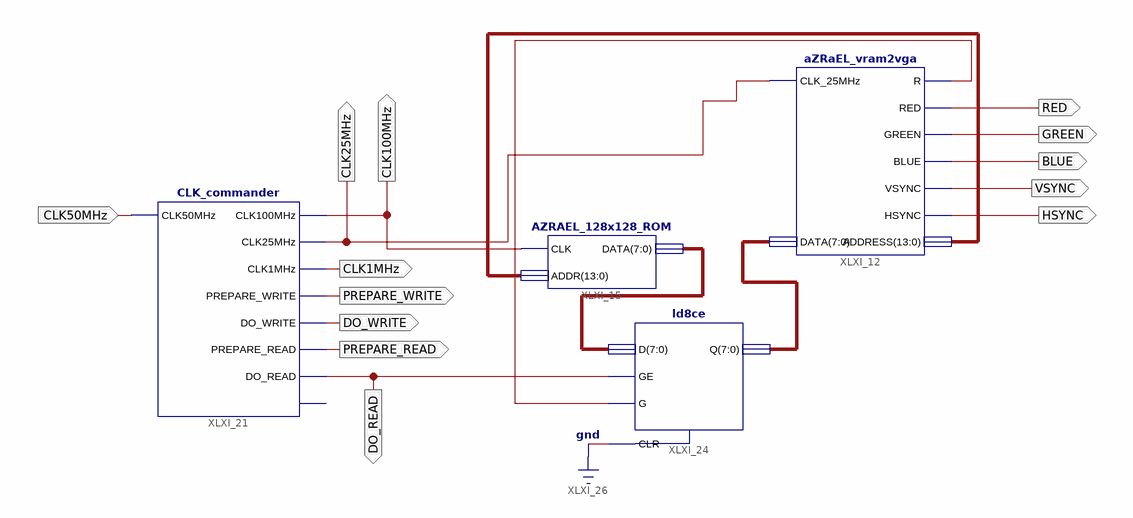
[diagram p0: schematic sheet 1]
// Xilinx ISE schematic aZRaEL2.sch (spartan3) as structural Verilog: 4 symbols, 13 ports
module aZRaEL2 (
  input  CLK50MHz,
  output RED,
  output GREEN,
  output BLUE,
  output VSYNC,
  output HSYNC,
  output DO_READ,
  output CLK1MHz,
  output PREPARE_WRITE,
  output DO_WRITE,
  output PREPARE_READ,
  output CLK100MHz,
  output CLK25MHz
);

  wire XLXN_63;
  wire [7:0] XLXN_31, XLXN_32;
  wire [13:0] XLXN_20;

  aZRaEL_vram2vga XLXI_12 (
    .CLK_25MHz(CLK25MHz), .DATA(XLXN_32), .R(XLXN_63), .RED(RED), .GREEN(GREEN), .BLUE(BLUE), .VSYNC(VSYNC),
    .HSYNC(HSYNC), .ADDRESS(XLXN_20));
  AZRAEL_128x128_ROM XLXI_15 (.CLK(CLK100MHz), .ADDR(XLXN_20), .DATA(XLXN_31));
  CLK_commander XLXI_21 (
    .CLK50MHz(CLK50MHz), .CLK100MHz(CLK100MHz), .CLK25MHz(CLK25MHz), .CLK1MHz(CLK1MHz),
    .PREPARE_WRITE(PREPARE_WRITE), .DO_WRITE(DO_WRITE), .PREPARE_READ(PREPARE_READ), .DO_READ(DO_READ));  // open: CLK4MHz
  ld8ce XLXI_24 (.CLR(1'b0), .D(XLXN_31), .G(XLXN_63), .GE(DO_READ), .Q(XLXN_32));
endmodule
